# Altium schematic sheet 07_FLASH_CONTROLLER.SchDoc: =title
size A3; Organization: 六零加智能科技; Address4: www.nidone.com.cn; DocumentNumber: kang jin; Revision: 1.0; SheetNumber: 7; SheetTotal: 23
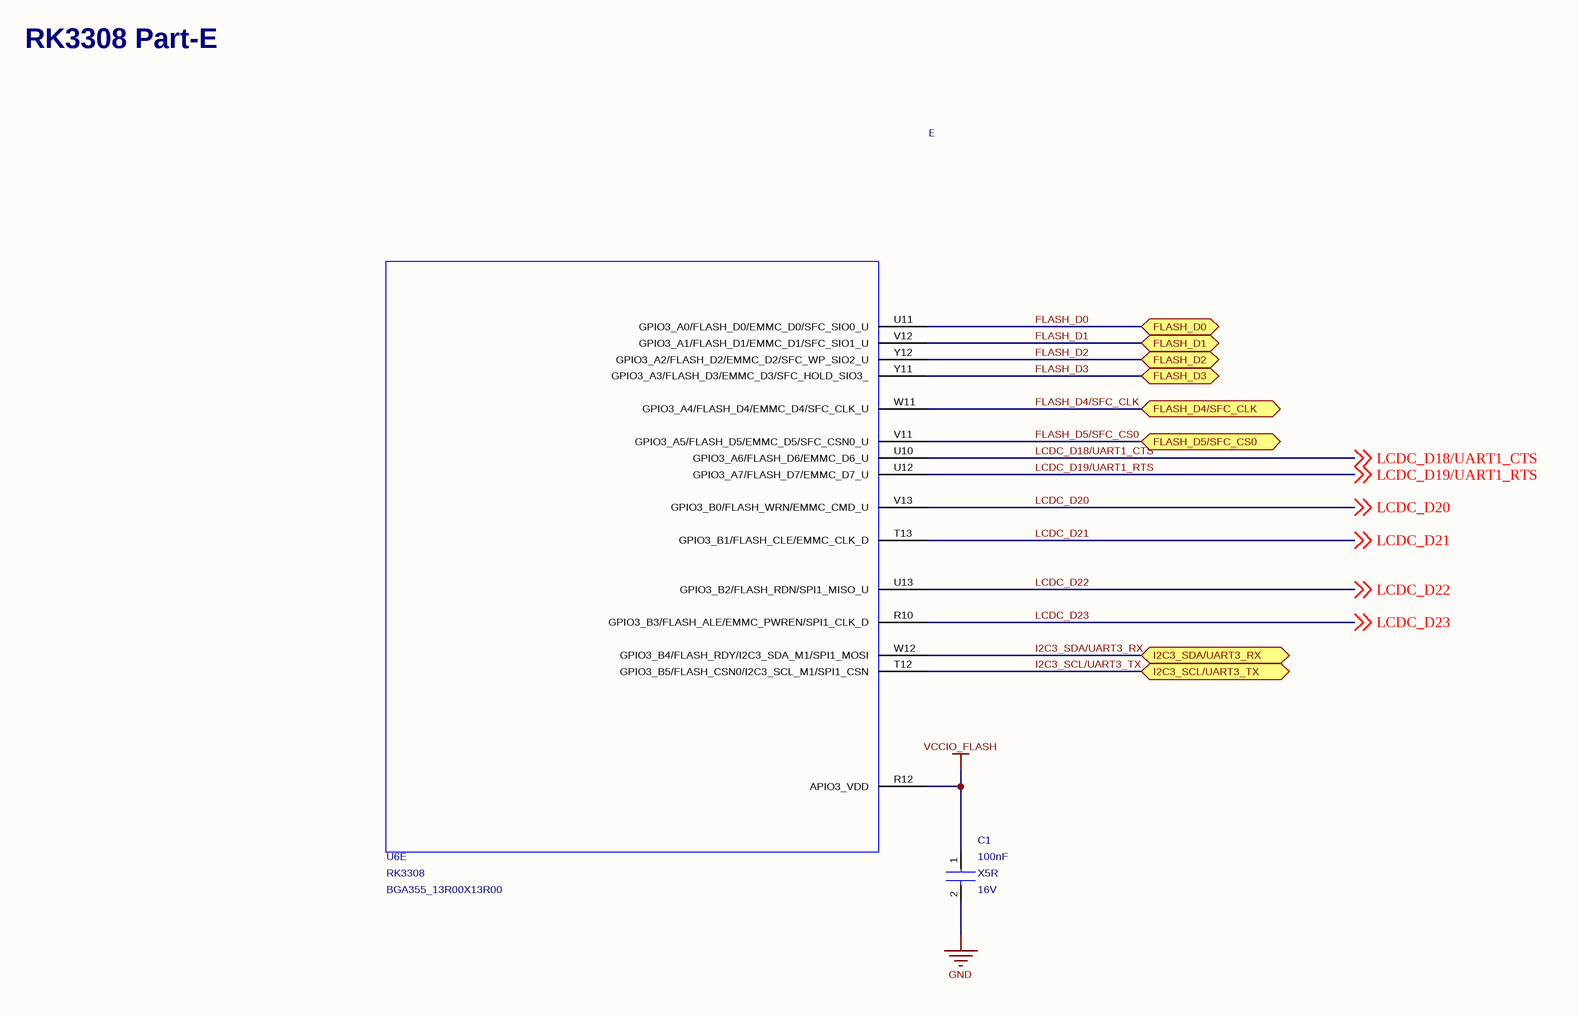
[diagram p0: 07_FLASH_CONTROLLER.SchDoc]

## Parts
C1  value 100nF  Dielectric: X5R  Voltage: 16V  [C0402]  (hidden comment: CAP_NP_2)
U6  RK3308  [BGA355_13R00X13R00]  (part E of 14)

## Ports
FLASH_D0 (bidir), FLASH_D1 (bidir), FLASH_D2 (bidir), FLASH_D3 (bidir), FLASH_D4/SFC_CLK (bidir), FLASH_D5/SFC_CS0 (bidir), I2C3_SCL/UART3_TX (bidir), I2C3_SDA/UART3_RX (bidir)

## Nets
GND: C1.2
VCCIO_FLASH: C1.1 U6.R12(APIO3_VDD)
FLASH_D0: U6.U11(GPIO3_A0/FLASH_D0/EMMC_D0/SFC_SIO0_U) ; port FLASH_D0
FLASH_D1: U6.V12(GPIO3_A1/FLASH_D1/EMMC_D1/SFC_SIO1_U) ; port FLASH_D1
FLASH_D2: U6.Y12(GPIO3_A2/FLASH_D2/EMMC_D2/SFC_WP_SIO2_U) ; port FLASH_D2
FLASH_D3: U6.Y11(GPIO3_A3/FLASH_D3/EMMC_D3/SFC_HOLD_SIO3_) ; port FLASH_D3
FLASH_D4/SFC_CLK: U6.W11(GPIO3_A4/FLASH_D4/EMMC_D4/SFC_CLK_U) ; port FLASH_D4/SFC_CLK
FLASH_D5/SFC_CS0: U6.V11(GPIO3_A5/FLASH_D5/EMMC_D5/SFC_CSN0_U) ; port FLASH_D5/SFC_CS0
I2C3_SCL/UART3_TX: U6.T12(GPIO3_B5/FLASH_CSN0/I2C3_SCL_M1/SPI1_CSN) ; port I2C3_SCL/UART3_TX
I2C3_SDA/UART3_RX: U6.W12(GPIO3_B4/FLASH_RDY/I2C3_SDA_M1/SPI1_MOSI) ; port I2C3_SDA/UART3_RX
LCDC_D18/UART1_CTS: U6.U10(GPIO3_A6/FLASH_D6/EMMC_D6_U) ; off-sheet LCDC_D18/UART1_CTS
LCDC_D19/UART1_RTS: U6.U12(GPIO3_A7/FLASH_D7/EMMC_D7_U) ; off-sheet LCDC_D19/UART1_RTS
LCDC_D20: U6.V13(GPIO3_B0/FLASH_WRN/EMMC_CMD_U) ; off-sheet LCDC_D20
LCDC_D21: U6.T13(GPIO3_B1/FLASH_CLE/EMMC_CLK_D) ; off-sheet LCDC_D21
LCDC_D22: U6.U13(GPIO3_B2/FLASH_RDN/SPI1_MISO_U) ; off-sheet LCDC_D22
LCDC_D23: U6.R10(GPIO3_B3/FLASH_ALE/EMMC_PWREN/SPI1_CLK_D) ; off-sheet LCDC_D23

## Notes on the sheet
- RK3308 Part-E
- E
- Title
- Size:
- Date:
- A3
- Engineer:
- Time:
- Revision:
- Sheet
- of
- File:

## Library data of the parts
C1 = CAP_NP_2: cap,100.00nF,+/-10%,16V,X5R,C0402; Manufacturer: TDK; RK_PN: C1005X5R1C104K050BA; Priority: A; Tolerance: 10%; Created_by: JJJ; Source_Path: Z:\RK_STANDARD_LIBRARY\CADENCE_CIS\RK_DISCRETE.OLB; Number: 1; PCB DECAL: C0402; Part_Type: C0402; Manufacturer_PN: C1005X5R1C104K050BA
U6 = RK3308: Manufacturer: ROCKCHIP; Source_Path: E:\SCHEMETIC\RKSCH.OLB; Number: 1; PCB DECAL: BGA355_13R00X13R00; Value: RK3308; Manufacturer_PN: RK3308